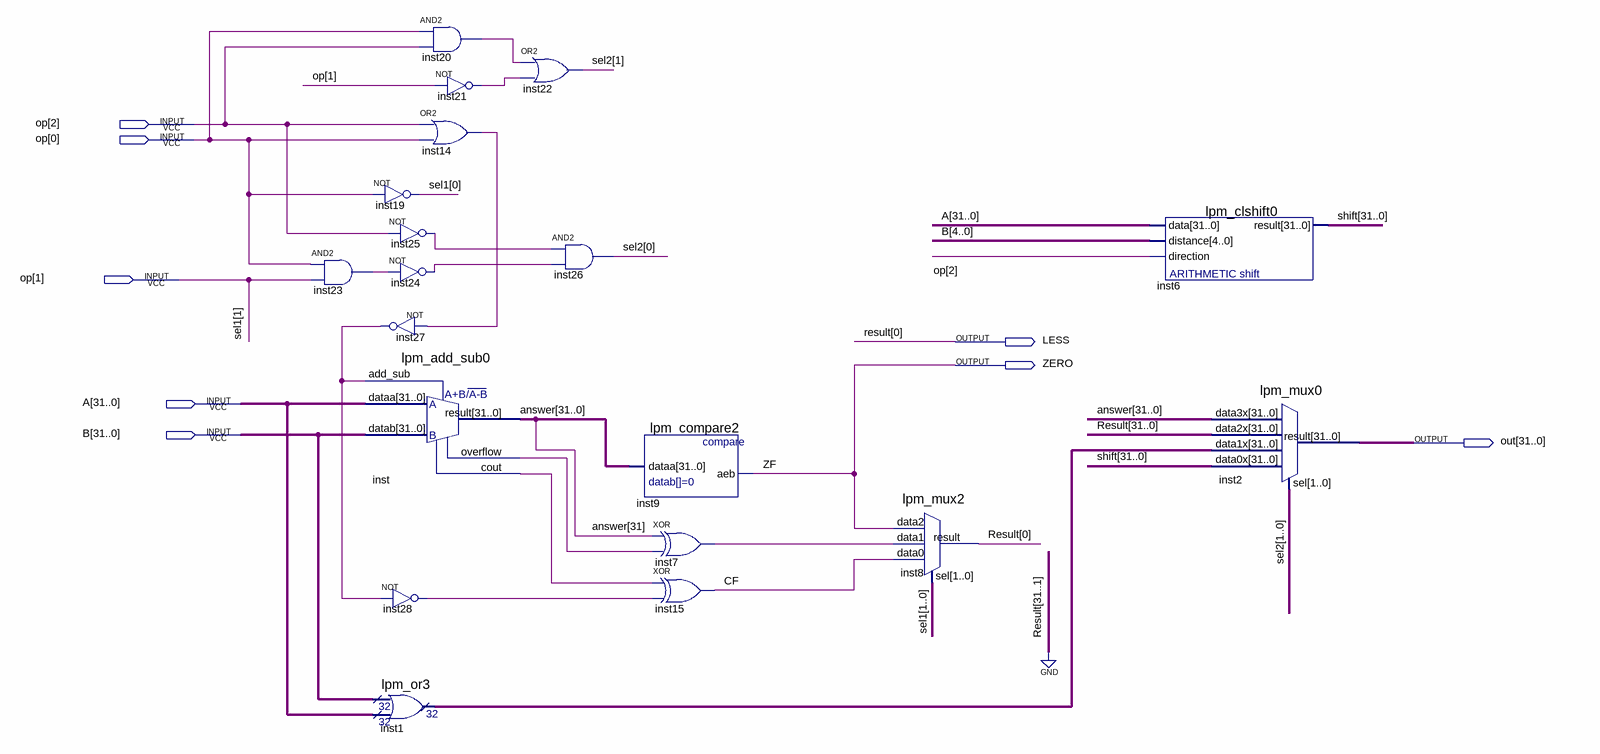
[diagram p0: schematic sheet]
// Quartus schematic ALU.bdf as structural Verilog: 19 symbols, 8 pins
module ALU (
  input  [2:0] op,
  input  [31:0] A,
  input  [31:0] B,
  output LESS,
  output ZERO,
  output [31:0] out
);

  wire CF, inst7_out, inst14_out, inst20_out, inst21_out, inst23_out, inst24_out, inst25_out, inst27_out,
       inst28_out, inst_cout, inst_overflow;
  wire [0:0] sel1;
  wire [1:0] sel2;
  wire [31:0] answer, inst1_result, shift;

  and inst23 (inst23_out, op[0], op[1]);
  not inst19 (sel1[0], op[0]);
  not inst27 (inst27_out, inst14_out);
  lpm_add_sub0 inst (
    .dataa(A), .datab(B), .add_sub(inst27_out), .result(answer), .overflow(inst_overflow), .cout(inst_cout));
  not inst28 (inst28_out, inst27_out);
  lpm_or3 inst1 (.data0x(B), .data1x(A), .result(inst1_result));
  and inst20 (inst20_out, op[0], op[2]);
  not inst21 (inst21_out, op[1]);
  or inst14 (inst14_out, op[2], op[0]);
  not inst25 (inst25_out, op[2]);
  not inst24 (inst24_out, inst23_out);
  or inst22 (sel2[1], inst20_out, inst21_out);
  and inst26 (sel2[0], inst25_out, inst24_out);
  lpm_compare2 inst9 (.dataa(answer), .aeb(ZERO));
  xor inst7 (inst7_out, answer[31], inst_overflow);
  xor inst15 (CF, inst_cout, inst28_out);
  lpm_mux2 inst8 (.data2(ZERO), .data1(inst7_out), .data0(CF), .sel({op[1], sel1[0]}), .result(LESS));
  lpm_clshift0 inst6 (.data(A), .distance(B[4:0]), .direction(op[2]), .result(shift));
  lpm_mux0 inst2 (
    .data3x(answer), .data2x({{31{1'b0}}, LESS}), .data1x(inst1_result), .data0x(shift), .sel(sel2),
    .result(out));

  // Other names for the same wires on the sheet: Result[0] = LESS; sel1[1] = op[1]; ZF = ZERO
endmodule
